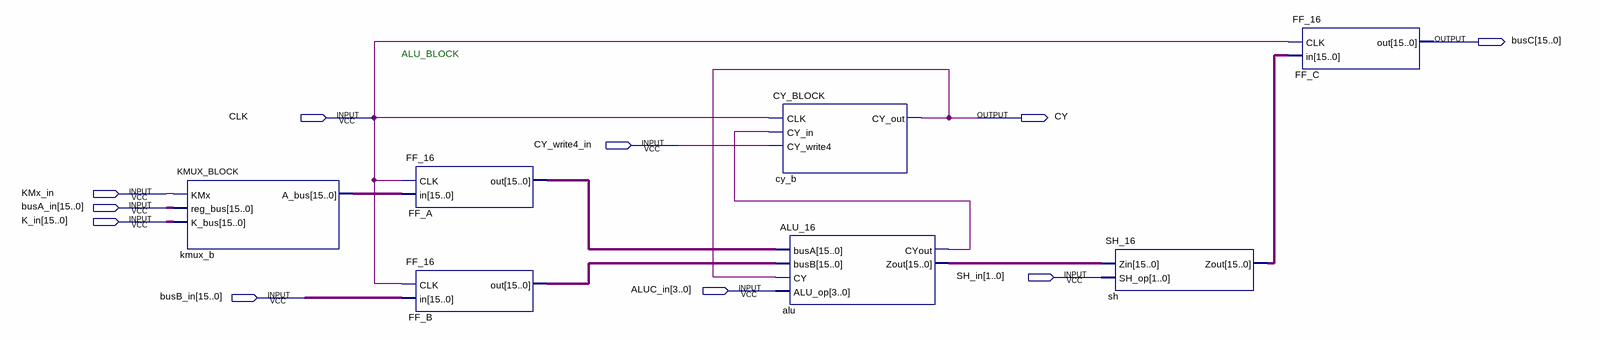
[diagram p0: schematic sheet]
// Quartus schematic ALU_BLOCK.bdf as structural Verilog: 7 symbols, 10 pins
module ALU_BLOCK (
  input  CLK,
  input  CY_write4_in,
  input  KMx_in,
  input  [15:0] busA_in,
  input  [15:0] K_in,
  input  [1:0] SH_in,
  input  [3:0] ALUC_in,
  input  [15:0] busB_in,
  output [15:0] busC,
  output CY
);

  wire alu_cyout;
  wire [15:0] alu_zout, FF_A_out, FF_B_out, kmux_b_a_bus, sh_zout;

  KMUX_BLOCK kmux_b (.KMx(KMx_in), .reg_bus(busA_in), .K_bus(K_in), .A_bus(kmux_b_a_bus));
  FF_16 FF_A (.CLK(CLK), .in(kmux_b_a_bus), .out(FF_A_out));
  FF_16 FF_B (.CLK(CLK), .in(busB_in), .out(FF_B_out));
  CY_BLOCK cy_b (.CLK(CLK), .CY_in(alu_cyout), .CY_write4(CY_write4_in), .CY_out(CY));
  ALU_16 alu (.busA(FF_A_out), .busB(FF_B_out), .CY(CY), .ALU_op(ALUC_in), .CYout(alu_cyout), .Zout(alu_zout));
  SH_16 sh (.Zin(alu_zout), .SH_op(SH_in), .Zout(sh_zout));
  FF_16 FF_C (.CLK(CLK), .in(sh_zout), .out(busC));

  // Notes on the sheet:
  //   ALU_BLOCK
endmodule
